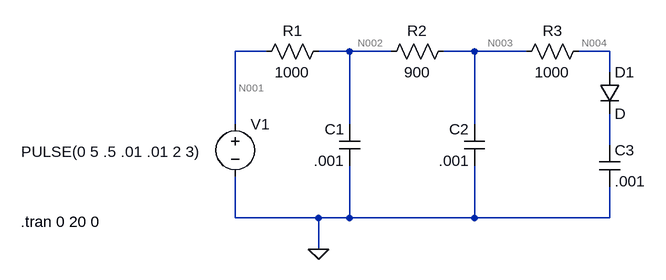
[diagram p0: schematic Draft3.asc]
Draft3.asc, the LTspice schematic file:
Version 4
SHEET 1 880 680
WIRE 144 16 96 16
WIRE 272 16 224 16
WIRE 336 16 272 16
WIRE 464 16 416 16
WIRE 544 16 464 16
WIRE 672 16 624 16
WIRE 672 48 672 16
WIRE 96 128 96 16
WIRE 272 128 272 16
WIRE 464 128 464 16
WIRE 672 160 672 112
WIRE 96 272 96 208
WIRE 224 272 96 272
WIRE 272 272 272 192
WIRE 272 272 224 272
WIRE 464 272 464 192
WIRE 464 272 272 272
WIRE 672 272 672 224
WIRE 672 272 464 272
WIRE 224 320 224 272
FLAG 224 320 0
SYMBOL voltage 96 112 R0
WINDOW 3 -329 58 Left 2
WINDOW 123 0 0 Left 0
WINDOW 39 0 0 Left 0
SYMATTR InstName V1
SYMATTR Value PULSE(0 5 .5 .01 .01 2 3)
SYMBOL cap 288 192 R180
WINDOW 0 24 56 Left 2
WINDOW 3 24 8 Left 2
SYMATTR InstName C1
SYMATTR Value .001
SYMBOL res 240 0 R90
WINDOW 0 0 56 VBottom 2
WINDOW 3 32 56 VTop 2
SYMATTR InstName R1
SYMATTR Value 1000
SYMBOL res 432 0 R90
WINDOW 0 0 56 VBottom 2
WINDOW 3 32 56 VTop 2
SYMATTR InstName R2
SYMATTR Value 900
SYMBOL cap 480 192 R180
WINDOW 0 24 56 Left 2
WINDOW 3 24 8 Left 2
SYMATTR InstName C2
SYMATTR Value .001
SYMBOL res 640 0 R90
WINDOW 0 0 56 VBottom 2
WINDOW 3 32 56 VTop 2
SYMATTR InstName R3
SYMATTR Value 1000
SYMBOL diode 656 48 R0
SYMATTR InstName D1
SYMBOL cap 656 160 R0
SYMATTR InstName C3
SYMATTR Value .001
TEXT -234 278 Left 2 !.tran 0 20 0

The netlist it stands for:
* Draft3.asc
V1 N001 0 PULSE(0 5 .5 .01 .01 2 3)
C1 0 N002 .001
R1 N002 N001 1000
R2 N003 N002 900
C2 0 N003 .001
R3 N004 N003 1000
D1 N004 N005 D
C3 N005 0 .001
.model D D
.lib standard.dio
.tran 0 20 0
.backanno
.end

* Results of the author's LTspice run, read from the files saved beside the schematic
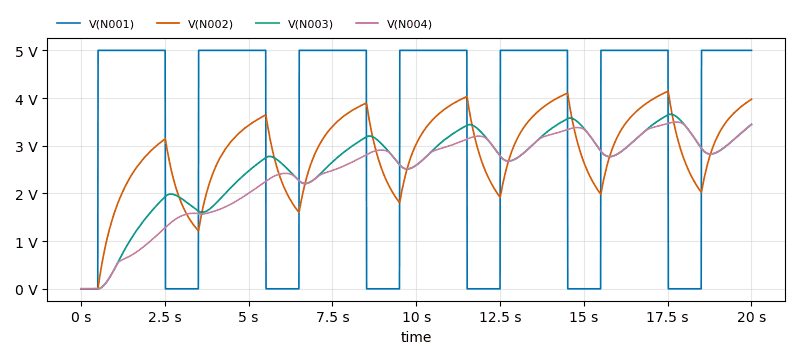
[diagram p1: Transient Analysis of Draft3.asc, plotted from the saved traces]
* Transient Analysis, 1 run:
*   V(N001): min 0 V, max 5 V, average 3.389 V, rms 4.114 V, last 5 V
*   V(N002): min 0 V, max 4.142 V, average 2.871 V, rms 3.011 V, last 3.974 V
*   V(N003): min 0 V, max 3.66 V, average 2.586 V, rms 2.725 V, last 3.45 V
*   V(N004): min 0 V, max 3.497 V, average 2.44 V, rms 2.601 V, last 3.442 V